# EAGLE design Transiver_Schematic (EAGLE 9.1.3)
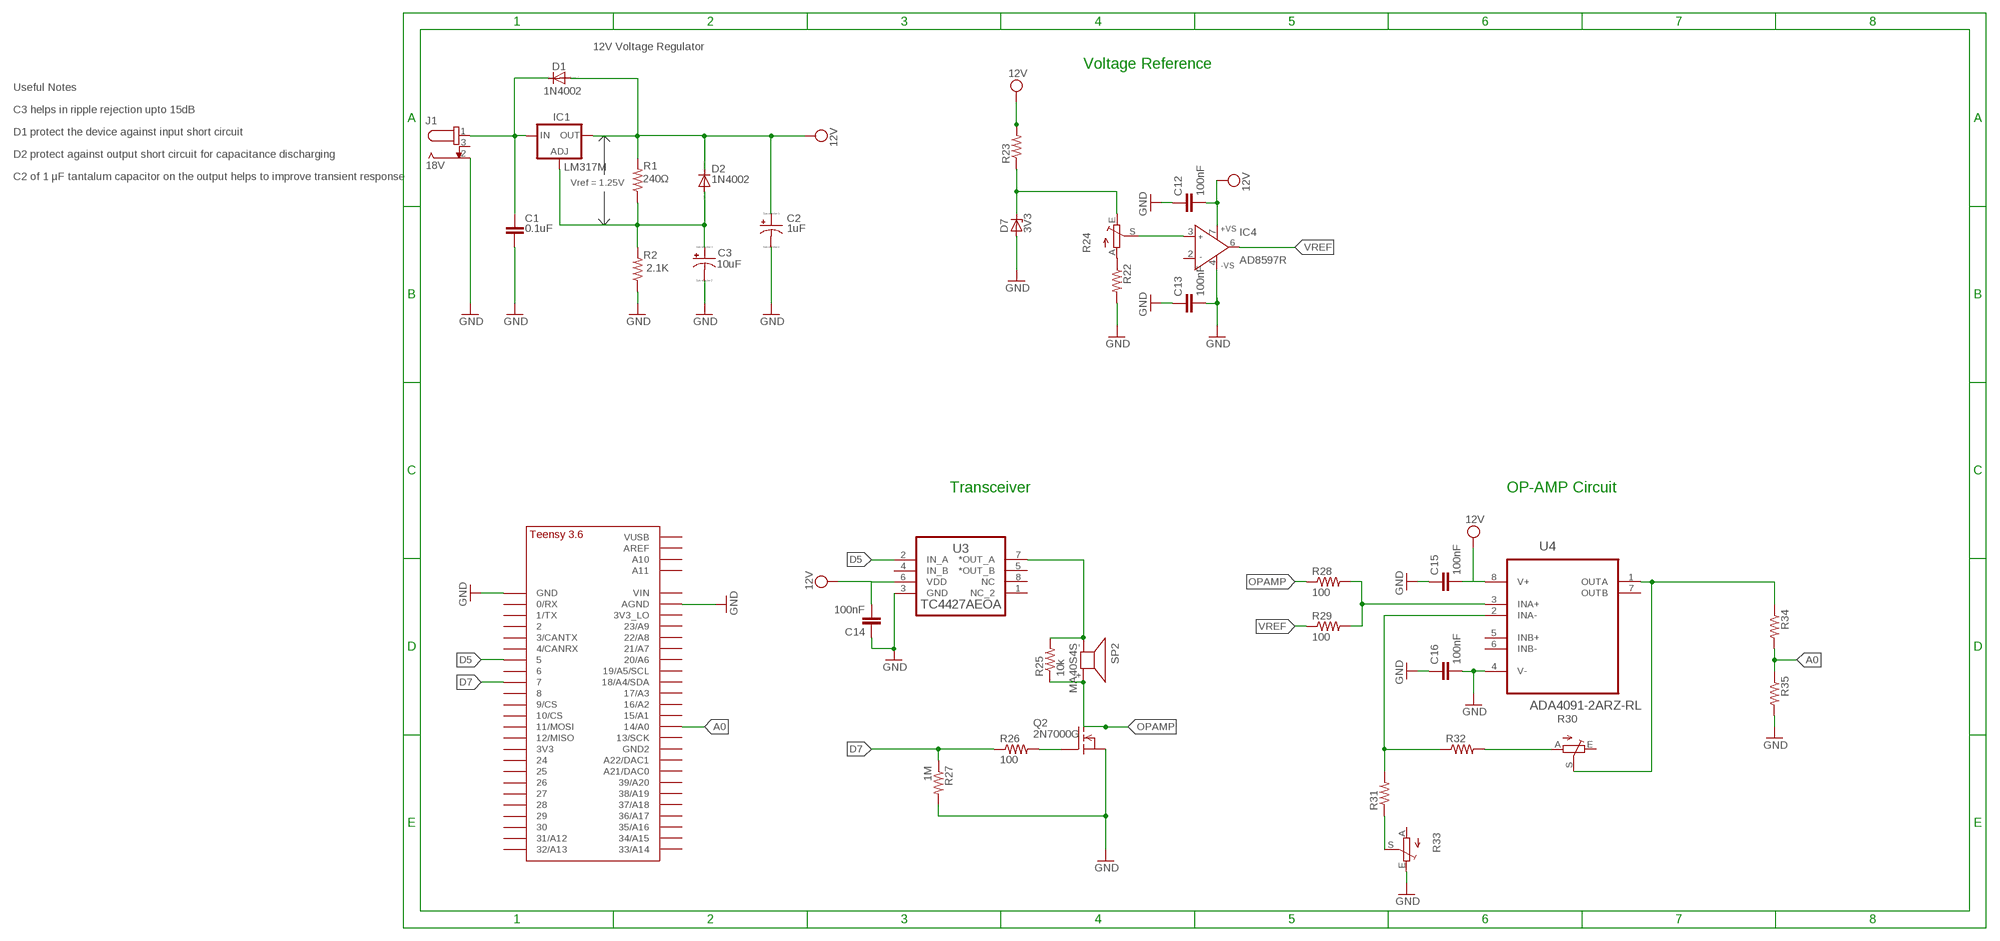
[diagram p0: schematic, sheet 1]

## Parts
C1  0.1uF  C-EU075-052X106  [C075-052X106]
C2  1uF  CPOL-US085CS-1AR  [085CS_1AR]
C3  10uF  CPOL-US085CS-1AR  [085CS_1AR]
C12  100nF  C2,5-3  [C2.5-3]
C13  100nF  C2,5-3  [C2.5-3]
C14  100nF  C2,5-3  [C2.5-3]
C15  100nF  C2,5-3  [C2.5-3]
C16  100nF  C2,5-3  [C2.5-3]
D1  1N4002  1N4004  [DO41-10]
D2  1N4002  1N4004  [DO41-10]
D7  3V3  1N4728  [DO41Z10]
IC1  LM317MBSTT3  [SOT223]
IC4  AD8597R  [SO8]
J1  18V  694102303002  [69410X303002]
Q2  2N7000G  [TO92-INLINE]
R1  240Ω  R-US_M0805  [M0805]
R2  2.1K  R-US_M0805  [M0805]
R22  R-US_M0805  [M0805]
R23  R-US_M0805  [M0805]
R24  TRIM_EU-CA6V  [CA6V]
R25  10k  R-US_R0805  [R0805]
R26  100  R-US_M0805  [M0805]
R27  1M  R-US_M0805  [M0805]
R28  100  R-US_M0805  [M0805]
R29  100  R-US_M0805  [M0805]
R30  TRIM_EU-CA6V  [CA6V]
R31  R-US_M0805  [M0805]
R32  R-US_M0805  [M0805]
R33  TRIM_EU-CA6V  [CA6V]
R34  R-US_M0805  [M0805]
R35  R-US_M0805  [M0805]
SP2  MA40S4S  [MA40]
U3  TC4427AEOA  [SOIC127P600X175-8N]
U4  ADA4091-2ARZ-RL  [SOIC127P600X175-8N]
U$1  TEENSY_3.5/3.6_BASIC  [TEENSY_3.5/3.6_BASIC]

## Nets
12V: C12.2 C15.2 IC4.7(+VS) U4.8(V+)
18V: C1.1 D1.C IC1.3(IN) J1.1
A0: R34.2 R35.1 U$1.14/A0
D5: U3.2(IN_A) U$1.5
D7: R26.1 R27.1 U$1.7
GND: C1.2 C2.- C3.- C12.1 C13.1 C13.2 C14.1 C15.1 C16.1 C16.2 D7.A IC4.4(-VS) J1.2 R2.1 R22.2 R33.E R35.2 U3.3(GND) U4.4(V-) U$1.AGND U$1.GND
N$1: C3.+ D2.A IC1.1(ADJ) R1.1 R2.2
N$23: IC4.3(IN+) R24.S
N$24: D7.C R23.1 R24.E
N$25: R22.1 R24.A
N$27: R28.2 R29.2 U4.3(INA+)
N$28: C14.2 U3.6(VDD)
N$30: R25.2 SP2.- U3.7(*OUT_A)
N$31: Q2.2(GATE) R26.2
N$33: R31.2 R32.1 U4.2(INA-)
N$34: R30.S R34.1 U4.1(OUTA)
N$36: R31.1 R33.S
N$37: R30.A R32.2
OPAMP: Q2.1(SRC) Q2.3(DRN) R25.1 R27.2 R28.1 SP2.+ ; supply symbol labelled GND
VDD: C2.+ D1.A D2.C IC1.4(OUT) R1.2 R23.2 ; supply symbol labelled 12V
VREF: IC4.6(OUT) R29.1
Unconnected: IC4.2(IN-) J1.3 R30.E R33.A U3.1(NC_2) U3.4(IN_B) U3.5(*OUT_B) U3.8(NC) U4.5(INB+) U4.6(INB-) U4.7(OUTB) U$1.0/RX U$1.1/TX U$1.2 U$1.3/CANTX U$1.3V3 U$1.3V3_LO U$1.4/CANRX U$1.6 U$1.8 U$1.9/CS U$1.10/CS U$1.11/MOSI U$1.12/MISO U$1.13/SCK U$1.15/A1 U$1.16/A2 U$1.17/A3 U$1.18/A4/SDA U$1.19/A5/SCL U$1.20/A6 U$1.21/A7 U$1.21/DAC0(A21/DAC0) U$1.22/A8 U$1.23/A9 U$1.24 U$1.25 U$1.26 U$1.27 U$1.28 U$1.29 U$1.30 U$1.31/A12 U$1.32/A13 U$1.33/A14 U$1.34/A15 U$1.35/A16 U$1.36/A17 U$1.37/A18 U$1.38/A19 U$1.39/A20 U$1.A10 U$1.A11 U$1.A22/DAC1 U$1.AREF U$1.GND2 U$1.VIN U$1.VUSB

## Notes on the sheet
- 12V Voltage Regulator
- Voltage Reference
- Useful Notes
- C3 helps in ripple rejection upto 15dB
- D1 protect the device against input short circuit
- D2 protect against output short circuit for capacitance discharging
- C2 of 1 µF tantalum capacitor on the output helps to improve transient response
- Vref = 1.25V
- Transceiver | OP-AMP Circuit

## Library data of the parts
C1 = rcl:C-EU: CAPACITOR, European symbol
C2 C3 = resistor:CPOL-US: POLARIZED CAPACITOR, American symbol
C12-C16 = capacitor-wima:C: CAPACITOR naming: grid - package width
D1 D2 = diode:1N4004: DIODE general purpose rectifier, 1 A
D7 = diode:1N4728: Z DIODE 3.3 V, 1W, 5 percent
IC1 = v-reg:LM317?*: 500 mA Adjustable Output Positive Voltage Regulator Source: http://www.onsemi.co.jp .. LM317M-D.PDF; PARTNUMBER: LM317M
IC4 = analog-devices:AD8597: Single and Dual, Ultralow Distortion, Ultralow Noise Op Amps Source: http://www.analog.com/static/imported-files/data_sheets/AD8597_8599.pdf; MPN: AD8597ARZ; OC_FARNELL: 1701258; OC_NEWARK: 19P8303
J1 = 694102303002:694102303002: WR-DC_DC Power Jack_Right Angled_THT Center Pin Ø1.0_Plug ID Ø1.05_Plug OD Ø3.5 ;=>Code : Con_WR-DC_THT_6941xx303002_694102303002 <http://katalog.we-online.de/media/images/eican/Con_WR-DC_THT_6941xx303002_pf2.jpg> Details see: http://katalog.we-online.de/em/datasheet/6941xx303002.pdf Created 2014-10-08, Karrer Zheng 2014 (C) Wurth Elektronik; DESCRIPTION: DC Power jack [Würth Elektronik] 694102303002 DC Power jack; MF: Wurth; MP: 694102303002; PACKAGE: None
Q2 = 2N7000G:2N7000G: N-Channel Enhancement MOSFET 60V; 200mA; 5 ohm; AVAILABILITY: Unavailable; DESCRIPTION: Mosfet n-Channel Enhancement Mode 60v 5; MF: Microchip; MP: 2N7000-G; PACKAGE: TO-92 Supertex; PRICE: None
R1 R2 R22 R23 R25-R29 R31 R32 R34 R35 = resistor:R-US_: RESISTOR, American symbol
R24 R30 R33 = pot:TRIM_EU-: POTENTIOMETER
SP2 = Parts:MA40S4S: SPEAKER Source: Buerklin
U3 = Parts:TC4427AEOA: IC, MOSFET DRIVER, LOW SIDE; MPN: TC4427AEOA; OC_FARNELL: 1292285; OC_NEWARK: 96K4020; PACKAGE: SOIC-8; SUPPLIER: Microchip
U4 = ADA4091-2ARZ-RL:ADA4091-2ARZ-RL: Precision Micropower Operational Amplifier; AVAILABILITY: Unavailable; DESCRIPTION: Ic Opamp Gp 1.27mhz Rro 8soic; MF: Analog; MP: ADA4091-2ARZ-RL; PACKAGE: SOIC-8 Analog Devices; PRICE: 3.30 USD
U$1 = Teensy356:TEENSY_3.5/3.6_BASIC

## Module F
Ports: 

### Library data of the parts

## Board
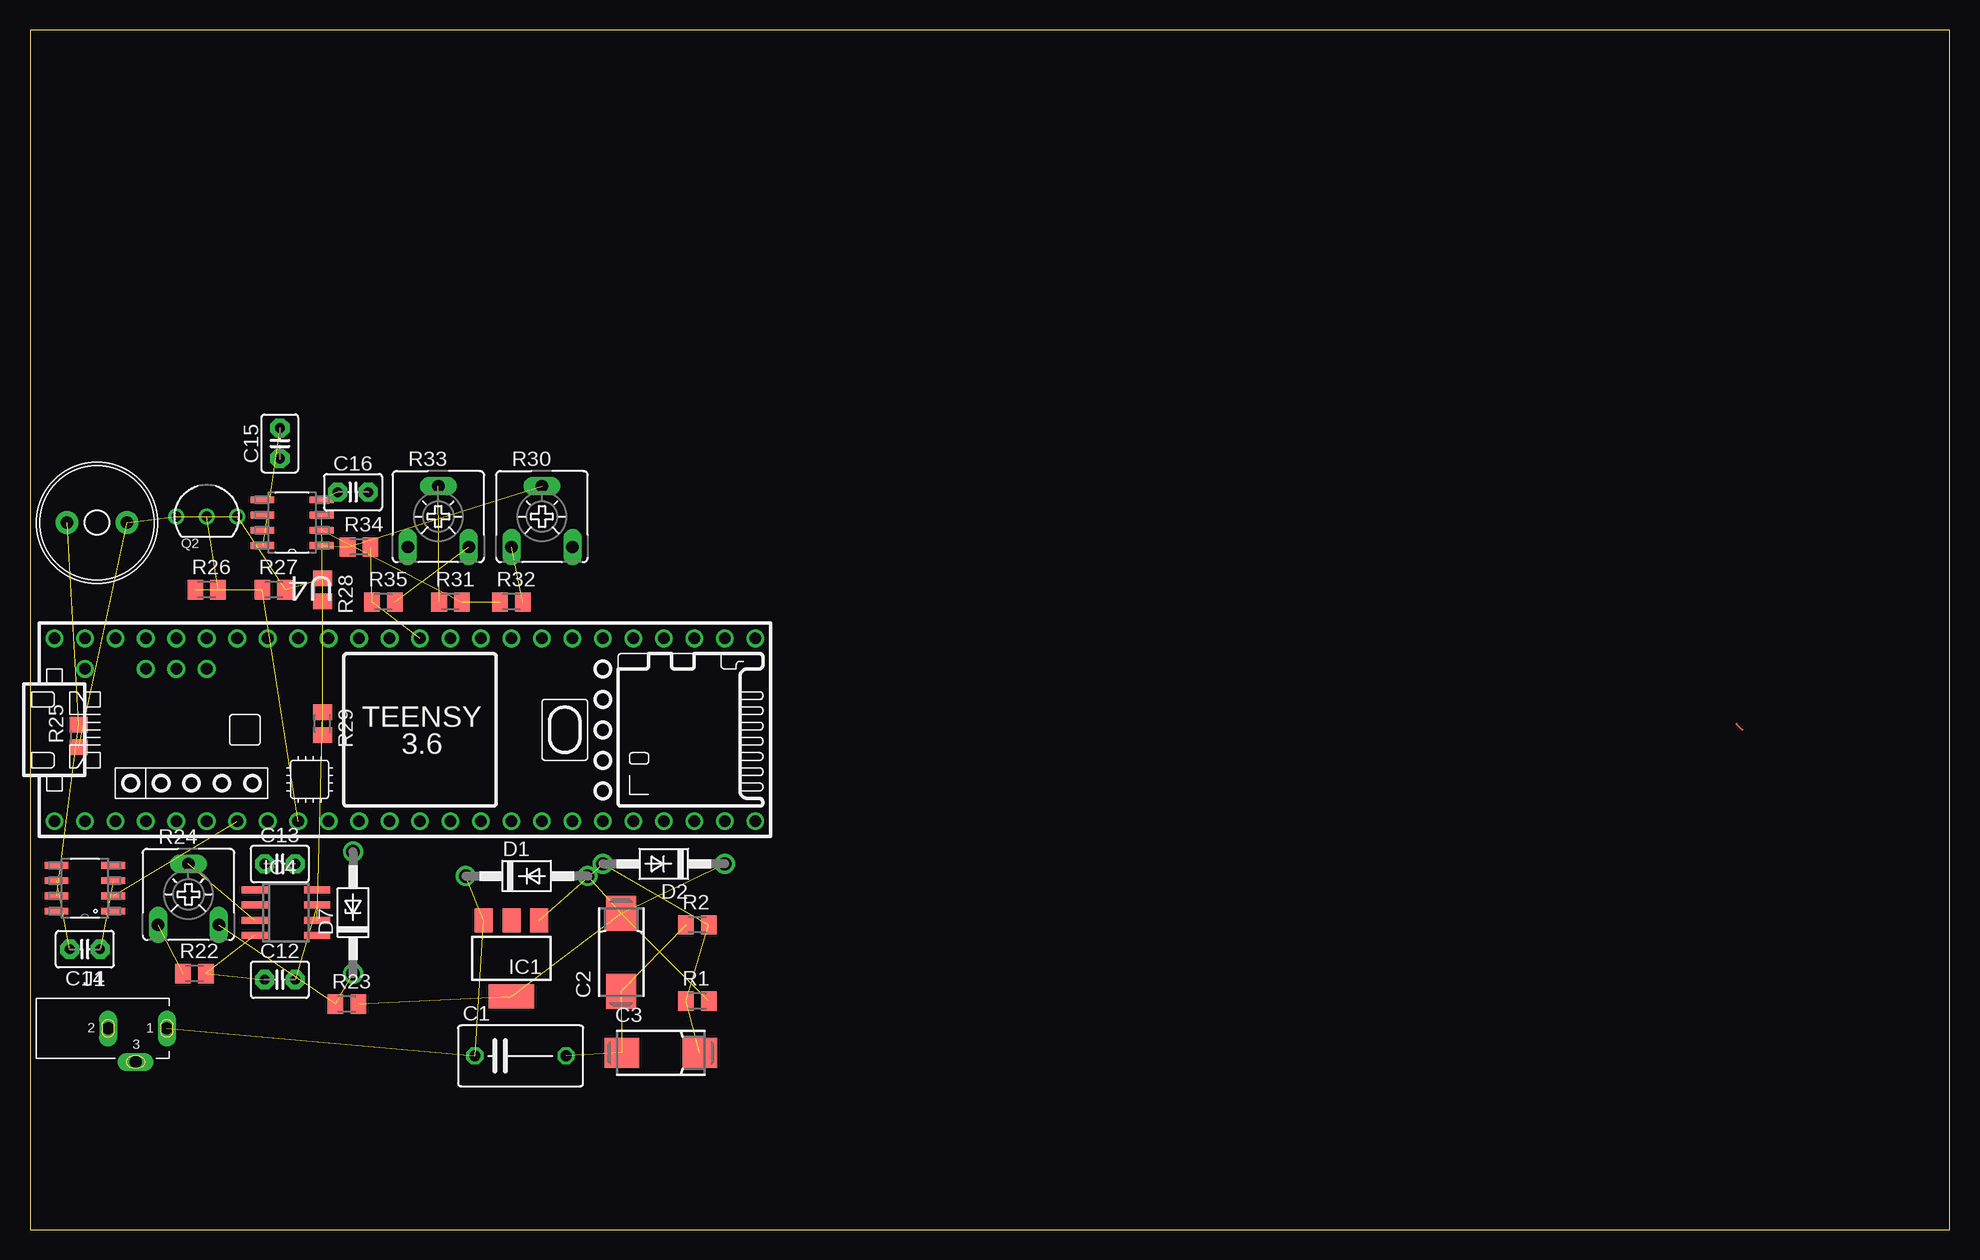
[diagram p1: board, top side]
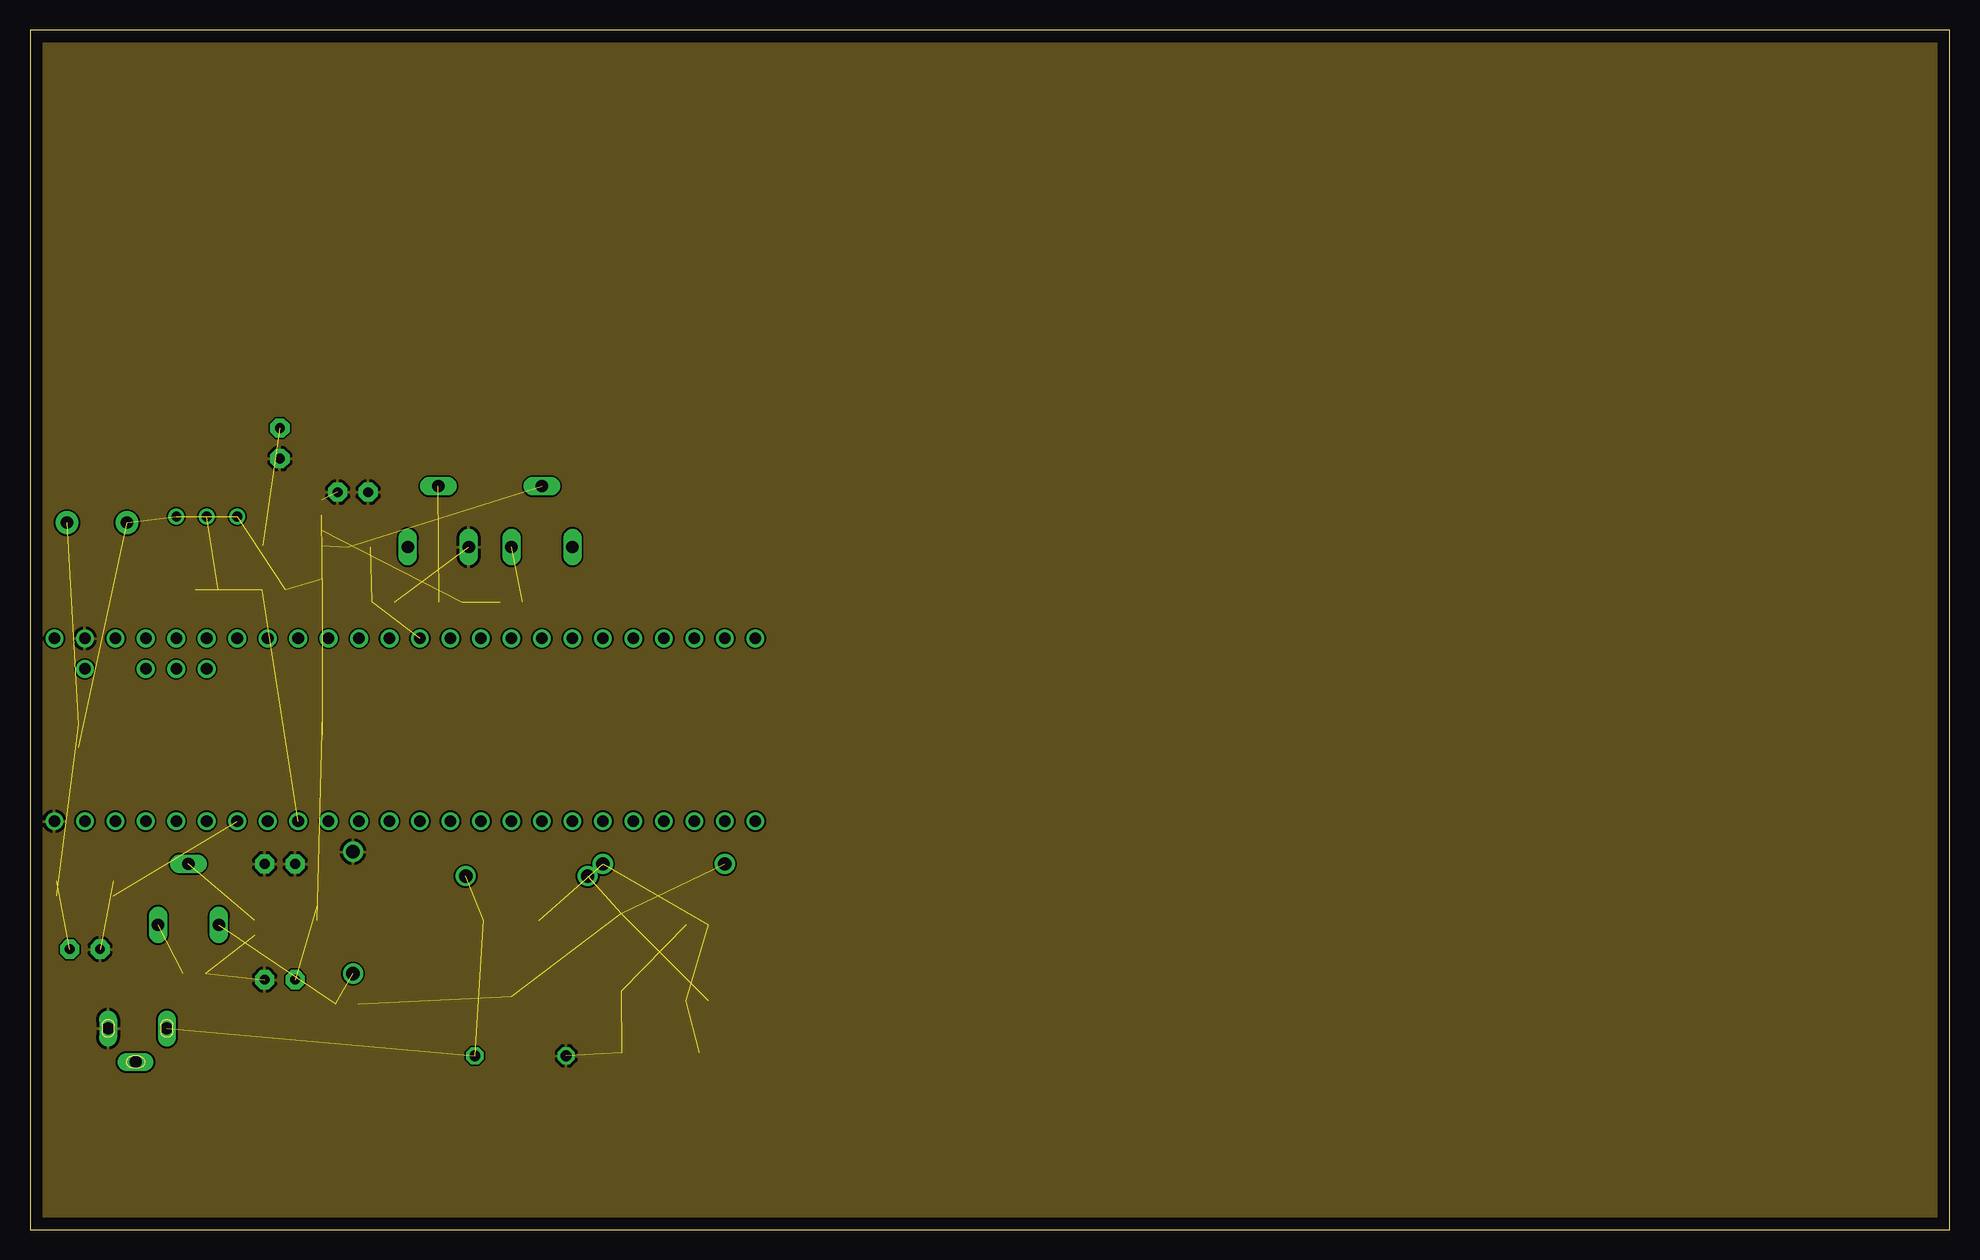
[diagram p2: board, inner layer GND]
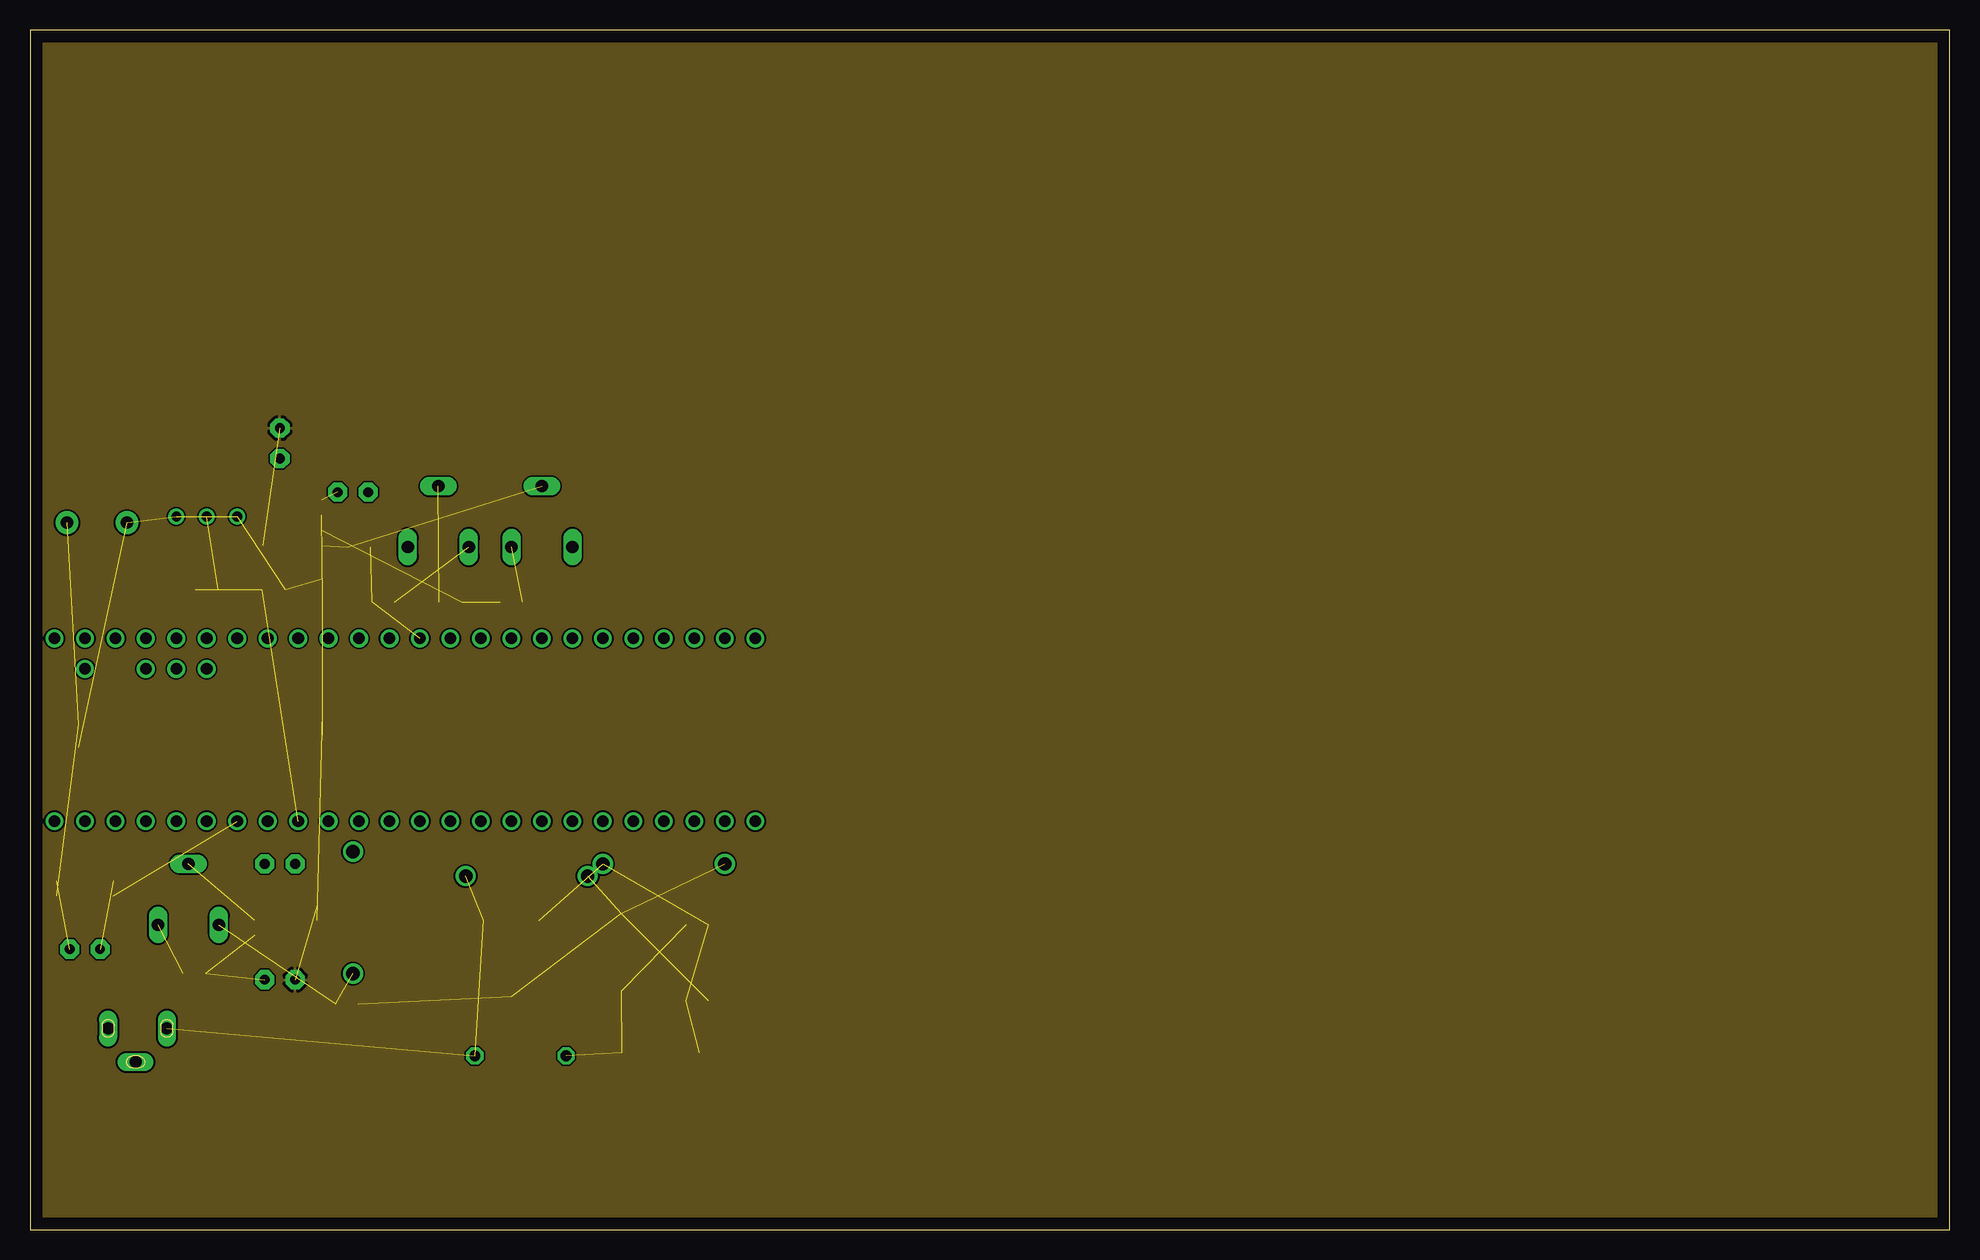
[diagram p3: board, inner layer 12V]

Size 160 x 100 mm. Coordinates in mm from the lower left corner, seen from the top.
Outline: 0,0 160,0 160,100 0,100 0,0
Copper layers (1*2*3*16): Top 0.035mm / dielectric 0.2mm / GND 0.0175mm / dielectric 0.3mm / 12V 0.035mm / dielectric 0.2mm / Bottom 0.035mm
Design rules "default *": minimum track width 6mil, minimum drill 0.35mm, track to track 6mil, track to pad 6mil, pad to pad 6mil, via to via 6mil, smd to smd 6mil, copper to edge 40mil, drill to drill 6mil, minimum pad ring 10mil, minimum via ring 8mil, stop-mask expansion 4mil, vias tented up to drill 0mil, thermal gap 10mil

### Footprints (pad centres in the part's own frame; a part is rotated, then mirrored left to right if it is on the bottom)
C075-052X106 = drill 0.914 octagon: 1 -3.81,0; 2 3.81,0
085CS_1AR = smd 2.9 x 2.5: + 3.25,0; - -3.25,0
C2.5-3 = drill 0.813 pad 1.6 octagon: 1 -1.27,0; 2 1.27,0
DO41-10 = drill 1.118: A 5.08,0; C -5.08,0
DO41Z10 = drill 1.118: A 5.08,0; C -5.08,0
SOT223 = smd 1.5 x 2: 1 -2.3,-3.15; 2 0,-3.15; 3 2.3,-3.15 | smd 3.8 x 2: 4 0,3.15
SO8 = smd 0.6 x 2.2: 1 -1.905,-2.6; 2 -0.635,-2.6; 3 0.635,-2.6; 4 1.905,-2.6; 5 1.905,2.6; 6 0.635,2.6; 7 -0.635,2.6; 8 -1.905,2.6
69410X303002 = drill 1 pad 1.5 long: 1 10.9,0; 2 6,0; 3 8.3,-2.8
TO92-INLINE = drill 0.8: 1 -2.54,0; 2 0,0; 3 2.54,0
M0805 = smd 1.3 x 1.6: 1 -0.95,0; 2 0.95,0
CA6V = drill 1.016 long: A -2.54,-2.54; E 2.54,-2.54; S 0,2.54
R0805 = smd 1.3 x 1.5: 1 -0.95,0; 2 0.95,0
MA40 = drill 1.016 pad 1.905: + 2.5,0; - -2.5,0
SOIC127P600X175-8N = smd 1.981 x 0.559: 1 -2.362,1.905; 2 -2.362,0.635; 3 -2.362,-0.635; 4 -2.362,-1.905; 5 2.362,-1.905; 6 2.362,-0.635; 7 2.362,0.635; 8 2.362,1.905
SOIC127P600X175-8N' = smd 1.981 x 0.559: 1 -2.464,1.905; 2 -2.464,0.635; 3 -2.464,-0.635; 4 -2.464,-1.905; 5 2.464,-1.905; 6 2.464,-0.635; 7 2.464,0.635; 8 2.464,1.905
TEENSY_3.5/3.6_BASIC = drill 0.965: 0/RX -25.4,-7.62; 1/TX -22.86,-7.62; 2 -20.32,-7.62; 3/CANTX -17.78,-7.62; 3V3 7.62,-7.62; 3V3_LO -22.86,7.62; 4/CANRX -15.24,-7.62; 5 -12.7,-7.62; 6 -10.16,-7.62; 7 -7.62,-7.62; 8 -5.08,-7.62; 9/CS -2.54,-7.62; 10/CS 0,-7.62; 11/MOSI 2.54,-7.62; 12/MISO 5.08,-7.62; 13/SCK 5.08,7.62; 14/A0 2.54,7.62; 15/A1 0,7.62; 16/A2 -2.54,7.62; 17/A3 -5.08,7.62; 18/A4/SDA -7.62,7.62; 19/A5/SCL -10.16,7.62; 20/A6 -12.7,7.62; 21/A7 -15.24,7.62; 21/DAC0 12.7,7.62; 22/A8 -17.78,7.62; 23/A9 -20.32,7.62; 24 10.16,-7.62; 25 12.7,-7.62; 26 15.24,-7.62; 27 17.78,-7.62; 28 20.32,-7.62; 29 22.86,-7.62; 30 25.4,-7.62; 31/A12 27.94,-7.62; 32/A13 30.48,-7.62; 33/A14 30.48,7.62; 34/A15 27.94,7.62; 35/A16 25.4,7.62; 36/A17 22.86,7.62; 37/A18 20.32,7.62; 38/A19 17.78,7.62; 39/A20 15.24,7.62; A10 -17.78,5.08; A11 -15.24,5.08; A22/DAC1 10.16,7.62; AGND -25.4,7.62; AREF -20.32,5.08; GND -27.94,-7.62; GND2 7.62,7.62; VIN -27.94,7.62; VUSB -25.4,5.08

### Placement (x,y rotation side)
C1  40.89,14.48 0 top
C2  49.28,23.11 90 top
C3  52.58,14.73 0 top
C12  20.83,20.83 0 top
C13  20.83,30.48 0 top
C14  4.57,23.37 180 top
C15  20.83,65.53 90 top
C16  26.92,61.47 0 top
D1  41.4,29.46 0 top
D2  52.83,30.48 180 top
D7  26.92,26.42 90 top
IC1  40.13,22.61 180 top
IC4  21.34,26.42 270 top
J1  0.51,16.76 0 top
Q2  14.73,59.44 0 top
R1  55.63,19.05 0 top
R2  55.63,25.4 0 top
R22  13.72,21.34 0 top
R23  26.42,18.8 0 top
R24  13.21,27.94 0 top
R25  4.06,41.15 90 top
R26  14.73,53.34 0 top
R27  20.32,53.34 0 top
R28  24.38,53.34 270 top
R29  24.38,42.16 270 top
R30  42.67,59.44 0 top
R31  35.05,52.32 0 top
R32  40.13,52.32 0 top
R33  34.04,59.44 0 top
R34  27.43,56.9 0 top
R35  29.46,52.32 0 top
SP2  5.59,58.93 0 top
U3  4.57,28.45 180 top
U4  ADA4091-2ARZ-RL  [SOIC127P600X175-8N']  21.84,58.93 180 top
U$1  29.97,41.66 0 top

### Tracks (layer width: path | path; a pad name or v marks a point on that pad's centre or on a via)
12V  (2 unrouted)
  pour 12V: -7.11,-5.08 -4.06,102.11 168.66,104.14 165.1,-5.59
18V  (3 unrouted)
A0  (2 unrouted)
D5  (1 unrouted)
D7  (2 unrouted)
GND  (8 unrouted)
  pour GND: -18.29,106.68 -18.8,-10.16 177.8,-10.16 177.29,105.16
N$1  (4 unrouted)
N$2
  Top 0.152: 142.24,42.16 142.75,41.66
N$23  (1 unrouted)
N$24  (2 unrouted)
N$25  (1 unrouted)
N$27  (2 unrouted)
N$28  (1 unrouted)
N$30  (2 unrouted)
N$31  (1 unrouted)
N$33  (2 unrouted)
N$34  (2 unrouted)
N$36  (1 unrouted)
N$37  (1 unrouted)
OPAMP  (5 unrouted)
VDD  (5 unrouted)
VREF  (1 unrouted)